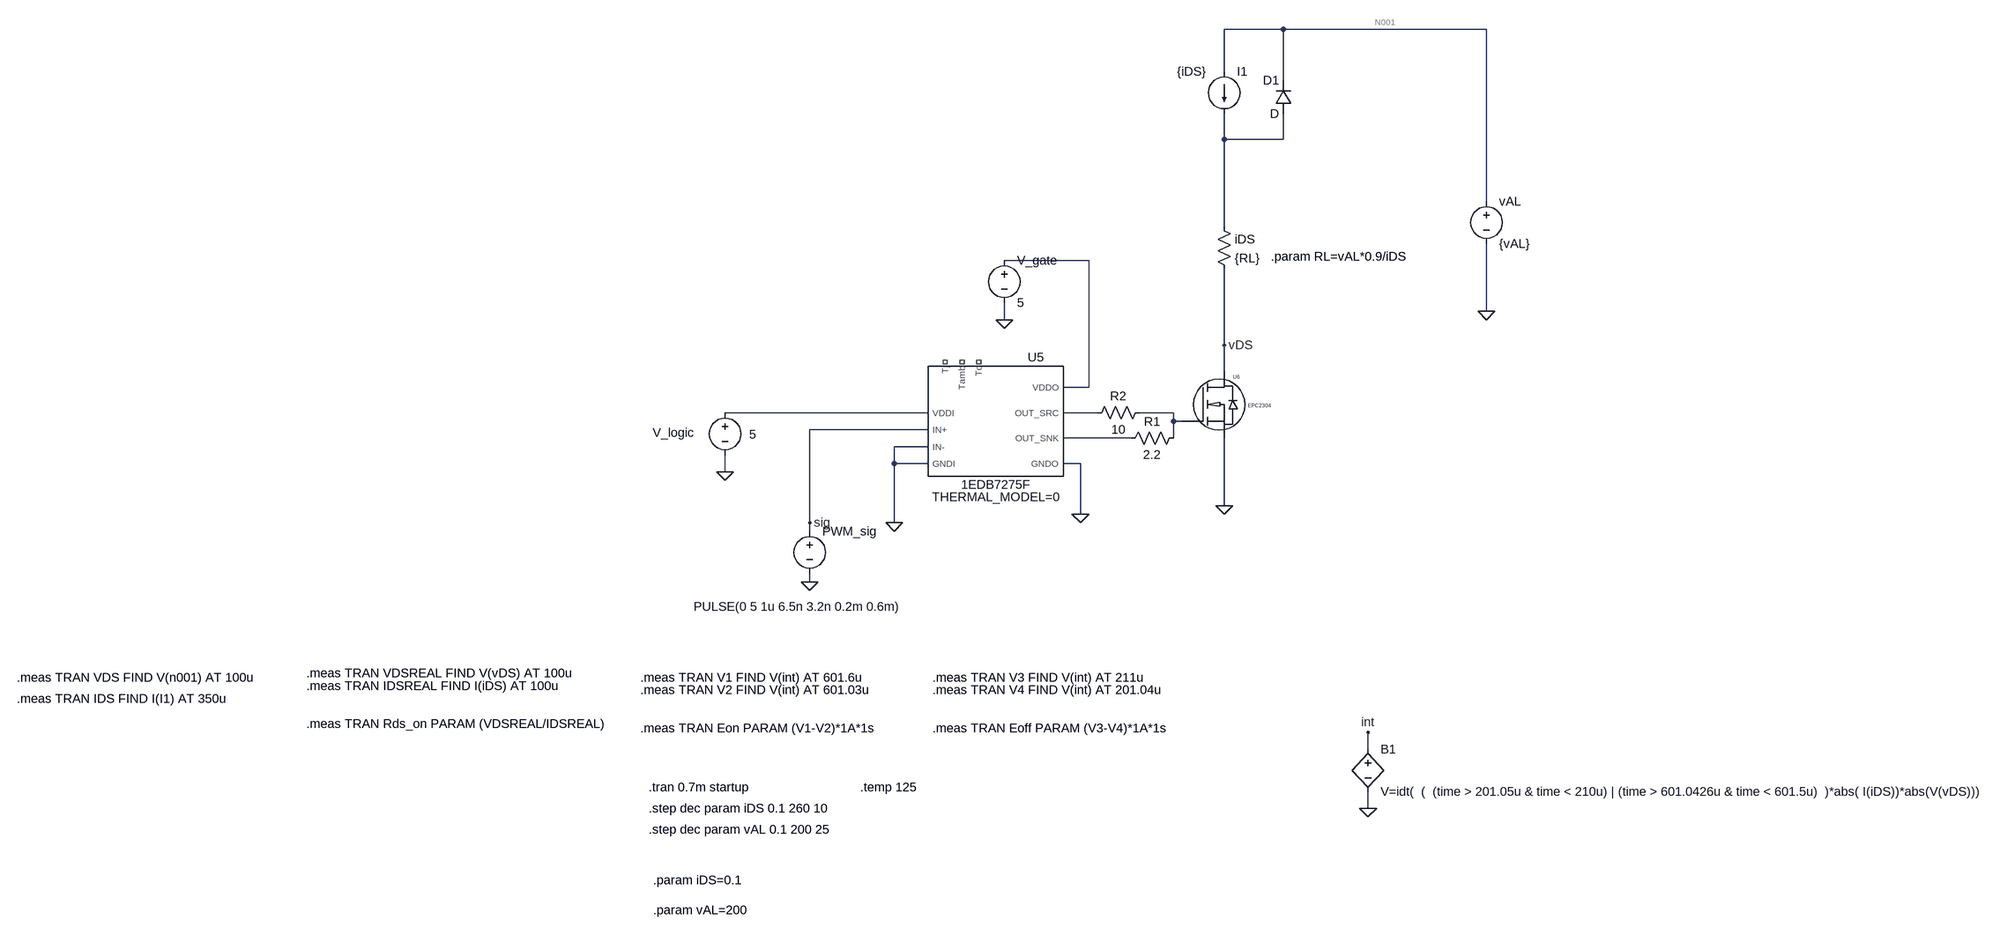
[diagram p0: schematic Eon_Eoff_circuit.asc]
Eon_Eoff_circuit.asc, the LTspice schematic file:
Version 4.1
SHEET 1 2348 1088
WIRE 704 -624 592 -624
WIRE 1088 -624 704 -624
WIRE 592 -544 592 -624
WIRE 704 -528 704 -624
WIRE 592 -416 592 -464
WIRE 704 -416 704 -464
WIRE 704 -416 592 -416
WIRE 1088 -272 1088 -624
WIRE 592 -224 592 -416
WIRE 336 -160 176 -160
WIRE 1088 -64 1088 -192
WIRE 176 -48 176 -80
WIRE 592 0 592 -144
WIRE 592 48 592 0
WIRE 336 80 336 -160
WIRE 336 80 288 80
WIRE 32 128 -352 128
WIRE 352 128 288 128
WIRE 496 128 432 128
WIRE 496 144 496 128
WIRE 512 144 496 144
WIRE 32 160 -192 160
WIRE 416 176 288 176
WIRE 496 176 496 144
WIRE 32 192 -32 192
WIRE -32 224 -32 192
WIRE 32 224 -32 224
WIRE 320 224 288 224
WIRE -352 240 -352 208
WIRE 592 304 592 176
WIRE 320 320 320 224
WIRE -192 336 -192 160
WIRE -32 336 -32 224
WIRE -192 352 -192 336
WIRE -192 448 -192 432
WIRE 864 768 864 736
WIRE 864 880 864 848
FLAG -352 240 0
FLAG -192 448 0
FLAG -32 336 0
FLAG -192 336 sig
FLAG 1088 -64 0
FLAG 864 880 0
FLAG 864 736 int
FLAG 592 304 0
FLAG 592 0 vDS
FLAG 320 320 0
FLAG 176 -48 0
SYMBOL voltage -192 336 R0
WINDOW 3 -219 159 Left 2
WINDOW 123 0 0 Left 0
WINDOW 39 0 0 Left 0
SYMATTR Value PULSE(0 5 1u 6.5n 3.2n 0.2m 0.6m)
SYMATTR InstName PWM_sig
SYMBOL voltage -352 112 R0
WINDOW 123 0 0 Left 0
WINDOW 39 0 0 Left 0
WINDOW 0 -137 54 Left 2
WINDOW 3 46 57 Left 2
SYMATTR InstName V_logic
SYMATTR Value 5
SYMBOL voltage 1088 -288 R0
WINDOW 123 0 0 Left 0
WINDOW 39 0 0 Left 0
SYMATTR InstName vAL
SYMATTR Value {vAL}
SYMBOL res 448 112 R90
WINDOW 0 0 56 VBottom 2
WINDOW 3 32 56 VTop 2
SYMATTR InstName R2
SYMATTR Value 10
SYMBOL bv 864 752 R0
SYMATTR InstName B1
SYMATTR Value V=idt(  (  (time > 201.05u & time < 210u) | (time > 601.0426u & time < 601.5u)  )*abs( I(iDS))*abs(V(vDS)))
SYMBOL res 576 -240 R0
SYMATTR InstName iDS
SYMATTR Value {RL}
SYMBOL current 592 -544 R0
WINDOW 3 -89 0 Left 2
SYMATTR Value {iDS}
SYMATTR InstName I1
SYMBOL diode 720 -464 R180
WINDOW 0 24 64 Left 2
WINDOW 3 24 0 Left 2
SYMATTR InstName D1
SYMBOL 1EDB7275F 160 144 R0
SYMATTR InstName U5
SYMATTR SpiceLine THERMAL_MODEL=0
SYMBOL res 512 160 R90
WINDOW 0 0 56 VBottom 2
WINDOW 3 32 56 VTop 2
SYMATTR InstName R1
SYMATTR Value 2.2
SYMBOL voltage 176 -176 R0
SYMATTR InstName V_gate
SYMATTR Value 5
SYMBOL EPCGaN 512 144 R0
SYMATTR InstName U6
TEXT -496 840 Left 2 !.tran 0.7m startup
TEXT -512 728 Left 2 !.meas TRAN Eon PARAM (V1-V2)*1A*1s
TEXT -512 632 Left 2 !.meas TRAN V1 FIND V(int) AT 601.6u
TEXT -512 656 Left 2 !.meas TRAN V2 FIND V(int) AT 601.03u
TEXT 40 632 Left 2 !.meas TRAN V3 FIND V(int) AT 211u
TEXT 40 656 Left 2 !.meas TRAN V4 FIND V(int) AT 201.04u
TEXT 40 728 Left 2 !.meas TRAN Eoff PARAM (V3-V4)*1A*1s
TEXT -496 880 Left 2 !.step dec param iDS 0.1 260 10
TEXT -496 920 Left 2 !.step dec param vAL 0.1 200 25
TEXT -488 1016 Left 2 !.param iDS=0.1
TEXT -488 1072 Left 2 !.param vAL=200
TEXT 680 -168 Left 2 !.param RL=vAL*0.9/iDS
TEXT -1144 648 Left 2 !.meas TRAN IDSREAL FIND I(iDS) AT 100u
TEXT -1144 624 Left 2 !.meas TRAN VDSREAL FIND V(vDS) AT 100u
TEXT -1144 720 Left 2 !.meas TRAN Rds_on PARAM (VDSREAL/IDSREAL)
TEXT -1728 632 Left 2 !.meas TRAN VDS FIND V(n001) AT 100u
TEXT -1728 672 Left 2 !.meas TRAN IDS FIND I(I1) AT 350u
TEXT -96 840 Left 2 !.temp 125

The netlist it stands for:
* Eon_Eoff_circuit.asc
V§PWM_sig sig 0 PULSE(0 5 1u 6.5n 3.2n 0.2m 0.6m)
V_logic N004 0 5
vAL N001 0 {vAL}
R2 N006 N005 10
B1 int 0 V=idt(  (  (time > 201.05u & time < 210u) | (time > 601.0426u & time < 601.5u)  )*abs( I(iDS))*abs(V(vDS)))
R§iDS N002 vDS {RL}
I1 N001 N002 {iDS}
D1 N002 N001 D
X§U5 N005 N003 sig 0 N004 NC_01 NC_02 NC_03 0 N007 0 1EDB7275F THERMAL_MODEL=0  ; pins OUT_SRC VDDO IN+ GNDI VDDI Tj Tamb Tc IN- OUT_SNK GNDO
R1 N006 N007 2.2
V_gate N003 0 5
X§U6 N006 vDS 0 EPC2304  ; pins gatein drainin N_0
.model D D
.lib standard.dio
.tran 0.7m startup
.meas TRAN Eon PARAM (V1-V2)*1A*1s
.meas TRAN V1 FIND V(int) AT 601.6u
.meas TRAN V2 FIND V(int) AT 601.03u
.meas TRAN V3 FIND V(int) AT 211u
.meas TRAN V4 FIND V(int) AT 201.04u
.meas TRAN Eoff PARAM (V3-V4)*1A*1s
.step dec param iDS 0.1 260 10
.step dec param vAL 0.1 200 25
.param iDS=0.1
.param vAL=200
.param RL=vAL*0.9/iDS
.meas TRAN IDSREAL FIND I(iDS) AT 100u
.meas TRAN VDSREAL FIND V(vDS) AT 100u
.meas TRAN Rds_on PARAM (VDSREAL/IDSREAL)
.meas TRAN VDS FIND V(n001) AT 100u
.meas TRAN IDS FIND I(I1) AT 350u
.temp 125
.lib 1EDB7275F.lib
.lib EPCGanlibrary.lib
.backanno
.end